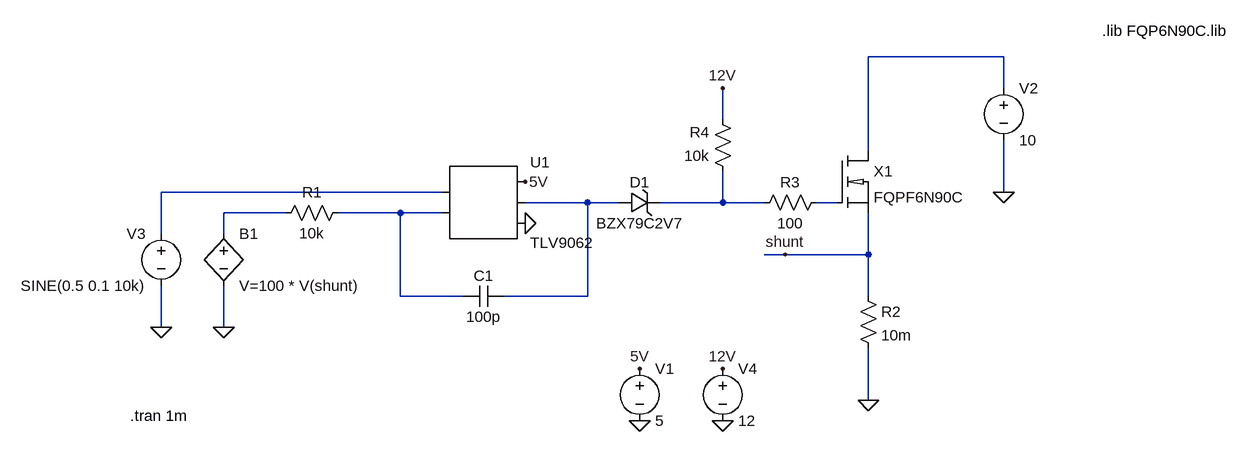
[diagram p0: schematic zener_gate_drive.asc]
zener_gate_drive.asc, the LTspice schematic file:
Version 4
SHEET 1 1396 680
WIRE 1040 -48 832 -48
WIRE 1040 0 1040 -48
WIRE 608 48 608 0
WIRE 832 96 832 -48
WIRE 176 160 -256 160
WIRE 1040 160 1040 80
WIRE 400 176 304 176
WIRE 448 176 400 176
WIRE 608 176 608 128
WIRE 608 176 512 176
WIRE 672 176 608 176
WIRE 784 176 752 176
WIRE -64 192 -160 192
WIRE 112 192 16 192
WIRE 176 192 112 192
WIRE -256 224 -256 160
WIRE -160 224 -160 192
WIRE 704 256 672 256
WIRE 832 256 832 192
WIRE 832 256 704 256
WIRE 112 320 112 192
WIRE 208 320 112 320
WIRE 400 320 400 176
WIRE 400 320 272 320
WIRE 832 320 832 256
WIRE -256 368 -256 304
WIRE -160 368 -160 304
WIRE 832 480 832 400
FLAG 304 208 0
FLAG 304 144 5V
FLAG 480 432 5V
FLAG 480 512 0
FLAG 832 480 0
FLAG 1040 160 0
FLAG 704 256 shunt
FLAG -160 368 0
FLAG -256 368 0
FLAG 608 432 12V
FLAG 608 512 0
FLAG 608 0 12V
SYMBOL AutoGenerated\\TLV9062 240 176 R0
SYMATTR InstName U1
SYMBOL voltage 480 416 R0
WINDOW 123 0 0 Left 0
WINDOW 39 0 0 Left 0
SYMATTR InstName V1
SYMATTR Value 5
SYMBOL res 32 176 R90
WINDOW 0 0 56 VBottom 2
WINDOW 3 32 56 VTop 2
SYMATTR InstName R1
SYMATTR Value 10k
SYMBOL cap 272 304 R90
WINDOW 0 0 32 VBottom 2
WINDOW 3 32 32 VTop 2
SYMATTR InstName C1
SYMATTR Value 100p
SYMBOL res 816 304 R0
SYMATTR InstName R2
SYMATTR Value 10m
SYMBOL voltage 1040 -16 R0
WINDOW 123 0 0 Left 0
WINDOW 39 0 0 Left 0
SYMATTR InstName V2
SYMATTR Value 10
SYMBOL bv -160 208 R0
SYMATTR InstName B1
SYMATTR Value V=100 * V(shunt)
SYMBOL voltage -256 208 M0
WINDOW 123 0 0 Left 0
WINDOW 39 0 0 Left 0
SYMATTR InstName V3
SYMATTR Value SINE(0.5 0.1 10k)
SYMBOL n_channel_mosfet 784 96 R0
SYMATTR InstName X1
SYMBOL res 768 160 R90
WINDOW 0 0 56 VBottom 2
WINDOW 3 32 56 VTop 2
SYMATTR InstName R3
SYMATTR Value 100
SYMBOL voltage 608 416 R0
WINDOW 123 0 0 Left 0
WINDOW 39 0 0 Left 0
SYMATTR InstName V4
SYMATTR Value 12
SYMBOL zener 448 192 R270
WINDOW 0 32 32 VTop 2
WINDOW 3 0 32 VBottom 2
SYMATTR InstName D1
SYMATTR Value BZX79C2V7
SYMATTR Description Diode
SYMATTR Type diode
SYMBOL res 624 144 R180
WINDOW 0 36 76 Left 2
WINDOW 3 36 40 Left 2
SYMATTR InstName R4
SYMATTR Value 10k
TEXT -304 504 Left 2 !.tran 1m
TEXT 1192 -88 Left 2 !.lib FQP6N90C.lib

The netlist it stands for:
* zener_gate_drive.asc
* U1: TLV9062 (symbol AutoGenerated\TLV9062 not available, pins judged from their places): pin1=N002 pin2=N007 pin3=5V pin4=N003 pin5=0
V1 5V 0 5
R1 N007 N006 10k
C1 N003 N007 100p
R2 shunt 0 10m
V2 N001 0 10
B1 N006 0 V=100 * V(shunt)
V3 N002 0 SINE(0.5 0.1 10k)
XX1 N001 N005 shunt FQPF6N90C  ; pins D G S
R3 N005 N004 100
V4 12V 0 12
D1 N003 N004 BZX79C2V7
R4 N004 12V 10k
.model D D
.lib standard.dio
.tran 1m
.lib FQP6N90C.lib
.lib FQP6N90C.lib
.backanno
.end